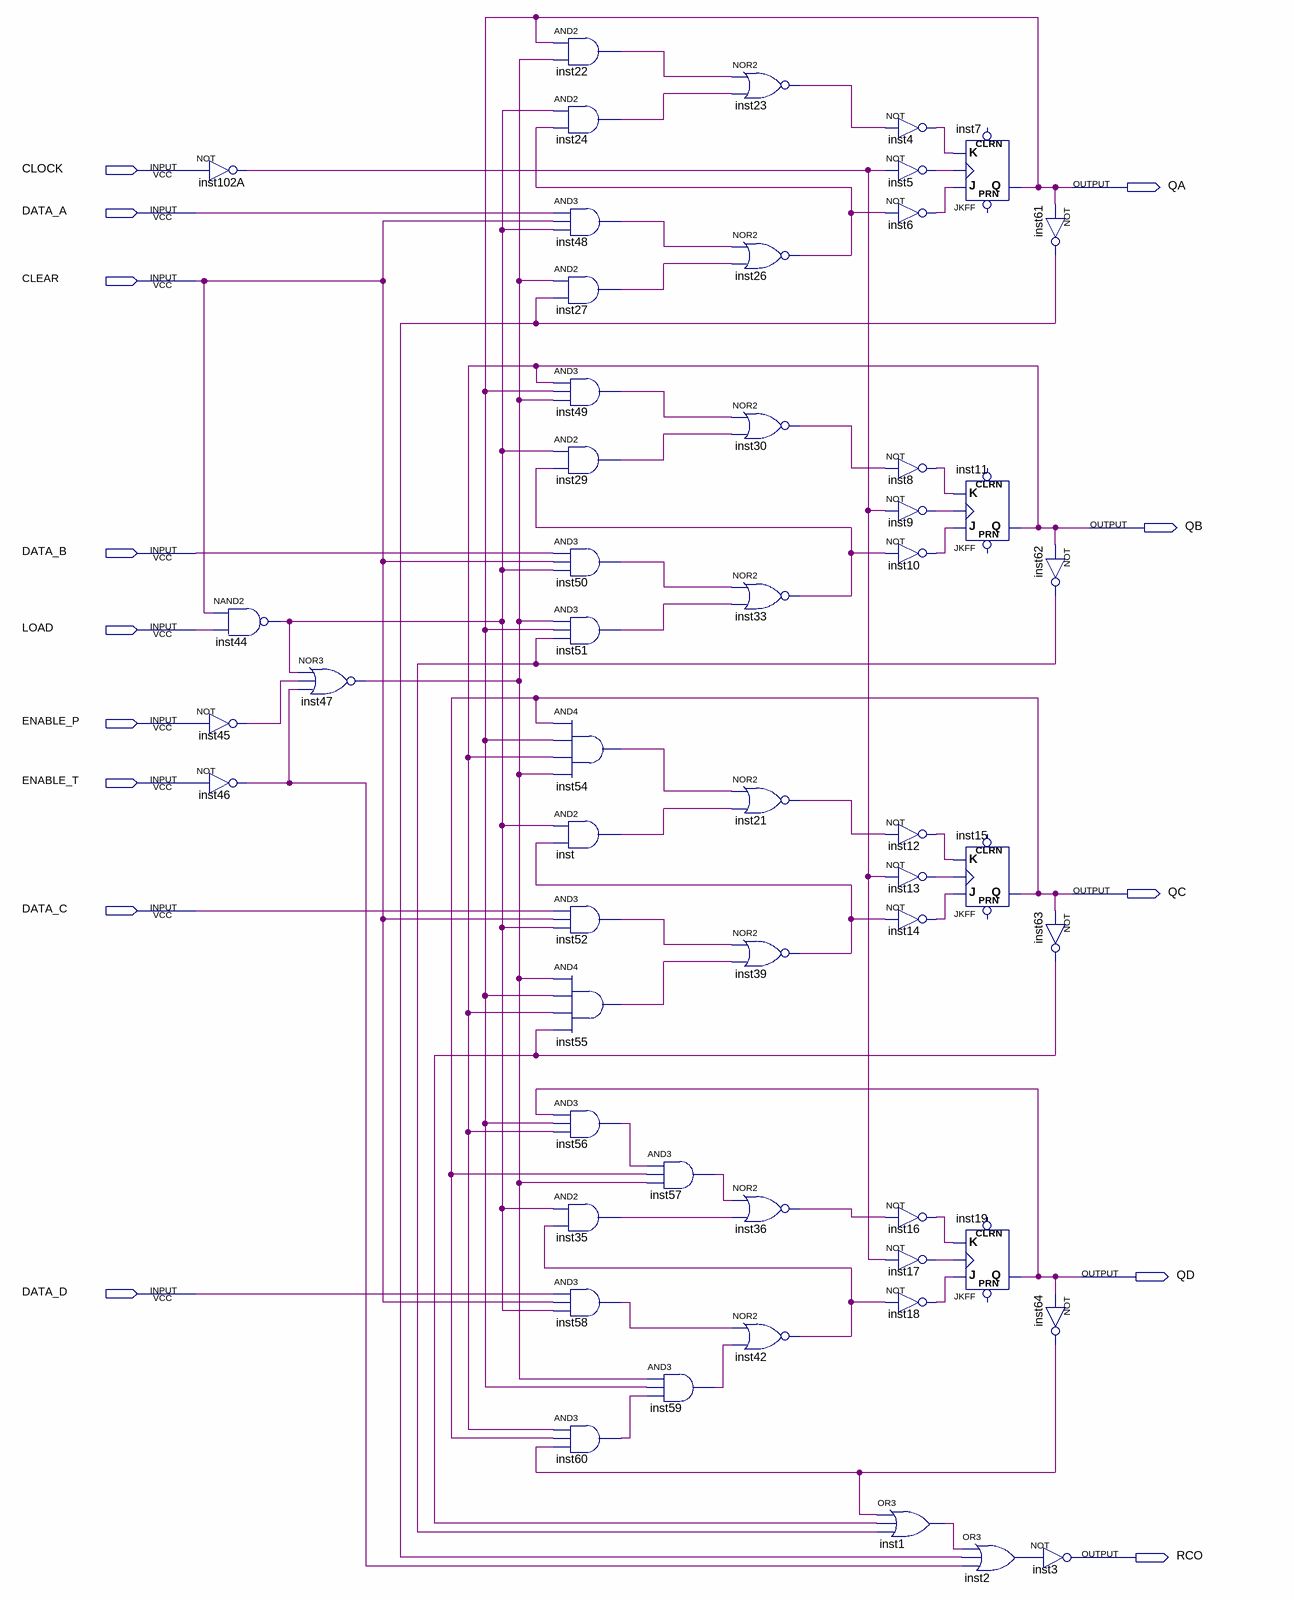
[diagram p0: schematic sheet]
// Quartus schematic DM74LS163A.bdf as structural Verilog: 54 symbols, 14 pins
module DM74LS163A (
  input  CLOCK,
  input  DATA_A,
  input  CLEAR,
  input  DATA_B,
  input  LOAD,
  input  ENABLE_P,
  input  ENABLE_T,
  input  DATA_C,
  input  DATA_D,
  output QA,
  output QB,
  output QC,
  output QD,
  output RCO
);

  wire inst1_out, inst2_out, inst4_out, inst5_out, inst6_out, inst8_out, inst9_out, inst10_out, inst12_out,
       inst13_out, inst14_out, inst16_out, inst17_out, inst18_out, inst21_out, inst22_out, inst23_out,
       inst24_out, inst26_out, inst27_out, inst29_out, inst30_out, inst33_out, inst35_out, inst36_out,
       inst39_out, inst42_out, inst44_out, inst45_out, inst46_out, inst47_out, inst48_out, inst49_out,
       inst50_out, inst51_out, inst52_out, inst54_out, inst55_out, inst56_out, inst57_out, inst58_out,
       inst59_out, inst60_out, inst61_out, inst62_out, inst63_out, inst64_out, inst102A_out, inst_out;

  not inst102A (inst102A_out, CLOCK);
  nand inst44 (inst44_out, CLEAR, LOAD);
  not inst45 (inst45_out, ENABLE_P);
  not inst46 (inst46_out, ENABLE_T);
  nor inst47 (inst47_out, inst44_out, inst45_out, inst46_out);
  and inst22 (inst22_out, QA, inst47_out);
  and inst24 (inst24_out, inst44_out, inst26_out);
  and inst48 (inst48_out, DATA_A, CLEAR, inst44_out);
  and inst27 (inst27_out, inst47_out, inst61_out);
  and inst49 (inst49_out, QB, QA, inst47_out);
  and inst29 (inst29_out, inst44_out, inst33_out);
  and inst50 (inst50_out, DATA_B, CLEAR, inst44_out);
  and inst51 (inst51_out, inst47_out, QA, inst62_out);
  and inst54 (inst54_out, QC, QA, QB, inst47_out);
  and inst (inst_out, inst44_out, inst39_out);
  and inst52 (inst52_out, DATA_C, CLEAR, inst44_out);
  and inst55 (inst55_out, inst47_out, QA, QB, inst63_out);
  and inst56 (inst56_out, QD, QA, QB);
  and inst35 (inst35_out, inst44_out, inst42_out);
  and inst58 (inst58_out, DATA_D, CLEAR, inst44_out);
  and inst60 (inst60_out, QB, QC, inst64_out);
  and inst57 (inst57_out, inst56_out, QC, inst47_out);
  and inst59 (inst59_out, inst47_out, QA, inst60_out);
  nor inst23 (inst23_out, inst22_out, inst24_out);
  nor inst26 (inst26_out, inst48_out, inst27_out);
  nor inst30 (inst30_out, inst49_out, inst29_out);
  nor inst33 (inst33_out, inst50_out, inst51_out);
  nor inst21 (inst21_out, inst54_out, inst_out);
  nor inst39 (inst39_out, inst52_out, inst55_out);
  nor inst36 (inst36_out, inst57_out, inst35_out);
  nor inst42 (inst42_out, inst58_out, inst59_out);
  not inst4 (inst4_out, inst23_out);
  not inst5 (inst5_out, inst102A_out);
  not inst6 (inst6_out, inst26_out);
  not inst8 (inst8_out, inst30_out);
  not inst9 (inst9_out, inst102A_out);
  not inst10 (inst10_out, inst33_out);
  not inst12 (inst12_out, inst21_out);
  not inst13 (inst13_out, inst102A_out);
  not inst14 (inst14_out, inst39_out);
  not inst16 (inst16_out, inst36_out);
  not inst17 (inst17_out, inst102A_out);
  not inst18 (inst18_out, inst42_out);
  or inst1 (inst1_out, inst64_out, inst63_out, inst62_out);
  JKFF inst7 (.K(inst4_out), .J(inst6_out), .CLK(inst5_out), .Q(QA));  // open: PRN, CLRN
  JKFF inst11 (.K(inst8_out), .J(inst10_out), .CLK(inst9_out), .Q(QB));  // open: PRN, CLRN
  JKFF inst15 (.K(inst12_out), .J(inst14_out), .CLK(inst13_out), .Q(QC));  // open: PRN, CLRN
  JKFF inst19 (.K(inst16_out), .J(inst18_out), .CLK(inst17_out), .Q(QD));  // open: PRN, CLRN
  or inst2 (inst2_out, inst1_out, inst61_out, inst46_out);
  not inst61 (inst61_out, QA);
  not inst62 (inst62_out, QB);
  not inst63 (inst63_out, QC);
  not inst64 (inst64_out, QD);
  not inst3 (RCO, inst2_out);
endmodule
